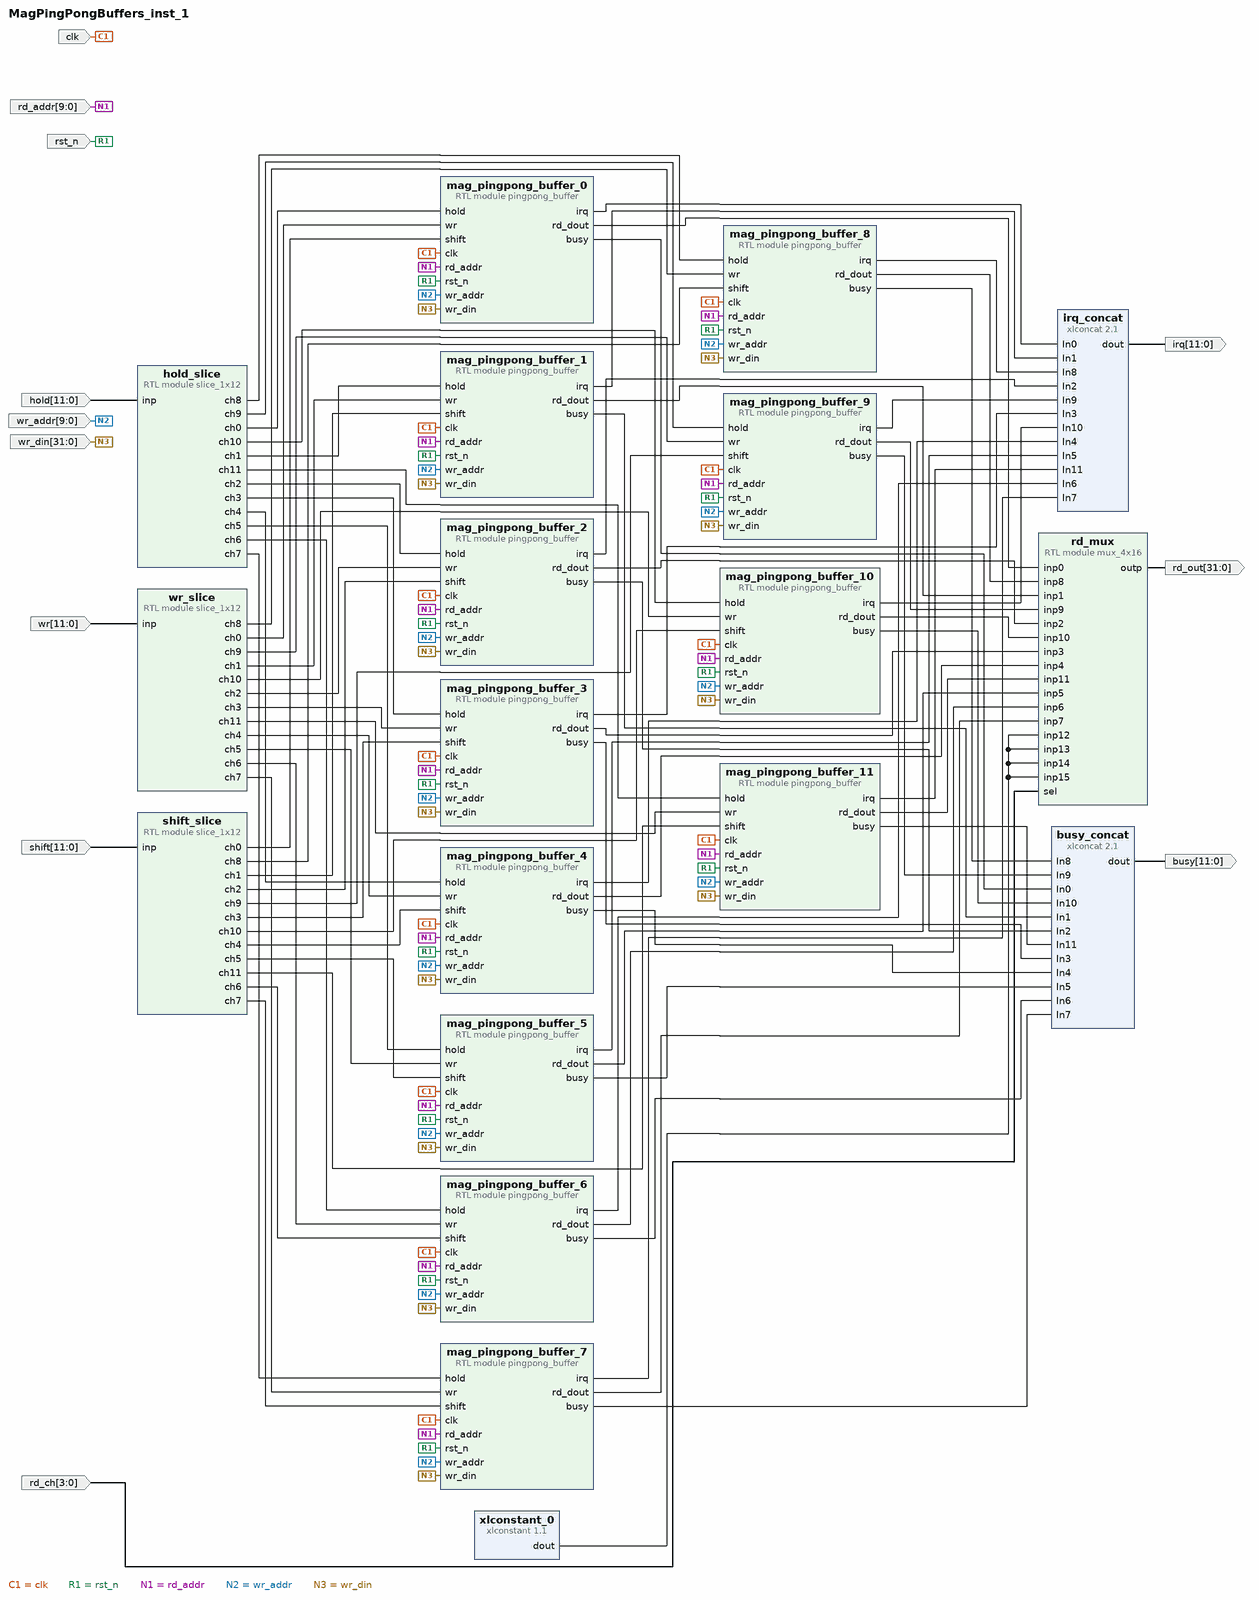
[diagram p0: block diagram of the top level]
# Vivado block design MagPingPongBuffers_inst_1, xczu3eg-sbva484-1-i, Vivado 2020.2
create_bd_design MagPingPongBuffers_inst_1

create_bd_port -dir I -type clk clk
create_bd_port -dir I -type rst rst_n
create_bd_port -dir I -from 9 -to 0 rd_addr
create_bd_port -dir I -from 9 -to 0 wr_addr
create_bd_port -dir I -from 11 -to 0 wr
create_bd_port -dir I -from 11 -to 0 hold
create_bd_port -dir I -from 11 -to 0 shift
create_bd_port -dir I -from 3 -to 0 rd_ch
create_bd_port -dir O -from 11 -to 0 busy
create_bd_port -dir O -from 11 -to 0 irq
create_bd_port -dir I -from 31 -to 0 wr_din
create_bd_port -dir O -from 31 -to 0 rd_out

create_bd_cell -type module -reference slice_1x12 hold_slice
create_bd_cell -type module -reference slice_1x12 shift_slice
create_bd_cell -type ip -vlnv xilinx.com:ip:xlconstant:1.1 xlconstant_0
set_property -dict {CONFIG.CONST_VAL 0 CONFIG.CONST_WIDTH 8} [get_bd_cells xlconstant_0]
create_bd_cell -type ip -vlnv xilinx.com:ip:xlconcat:2.1 busy_concat
set_property -dict {CONFIG.NUM_PORTS 12} [get_bd_cells busy_concat]
create_bd_cell -type ip -vlnv xilinx.com:ip:xlconcat:2.1 irq_concat
set_property -dict {CONFIG.NUM_PORTS 12} [get_bd_cells irq_concat]
create_bd_cell -type module -reference pingpong_buffer mag_pingpong_buffer_0
set_property -dict {CONFIG.addr_width 10 CONFIG.word_width 32} [get_bd_cells mag_pingpong_buffer_0]
create_bd_cell -type module -reference pingpong_buffer mag_pingpong_buffer_10
set_property -dict {CONFIG.addr_width 10 CONFIG.word_width 32} [get_bd_cells mag_pingpong_buffer_10]
create_bd_cell -type module -reference pingpong_buffer mag_pingpong_buffer_11
set_property -dict {CONFIG.addr_width 10 CONFIG.word_width 32} [get_bd_cells mag_pingpong_buffer_11]
create_bd_cell -type module -reference pingpong_buffer mag_pingpong_buffer_1
set_property -dict {CONFIG.addr_width 10 CONFIG.word_width 32} [get_bd_cells mag_pingpong_buffer_1]
create_bd_cell -type module -reference pingpong_buffer mag_pingpong_buffer_2
set_property -dict {CONFIG.addr_width 10 CONFIG.word_width 32} [get_bd_cells mag_pingpong_buffer_2]
create_bd_cell -type module -reference pingpong_buffer mag_pingpong_buffer_3
set_property -dict {CONFIG.addr_width 10 CONFIG.word_width 32} [get_bd_cells mag_pingpong_buffer_3]
create_bd_cell -type module -reference pingpong_buffer mag_pingpong_buffer_4
set_property -dict {CONFIG.addr_width 10 CONFIG.word_width 32} [get_bd_cells mag_pingpong_buffer_4]
create_bd_cell -type module -reference pingpong_buffer mag_pingpong_buffer_5
set_property -dict {CONFIG.addr_width 10 CONFIG.word_width 32} [get_bd_cells mag_pingpong_buffer_5]
create_bd_cell -type module -reference pingpong_buffer mag_pingpong_buffer_6
set_property -dict {CONFIG.addr_width 10 CONFIG.word_width 32} [get_bd_cells mag_pingpong_buffer_6]
create_bd_cell -type module -reference pingpong_buffer mag_pingpong_buffer_7
set_property -dict {CONFIG.addr_width 10 CONFIG.word_width 32} [get_bd_cells mag_pingpong_buffer_7]
create_bd_cell -type module -reference pingpong_buffer mag_pingpong_buffer_8
set_property -dict {CONFIG.addr_width 10 CONFIG.word_width 32} [get_bd_cells mag_pingpong_buffer_8]
create_bd_cell -type module -reference pingpong_buffer mag_pingpong_buffer_9
set_property -dict {CONFIG.addr_width 10 CONFIG.word_width 32} [get_bd_cells mag_pingpong_buffer_9]
create_bd_cell -type module -reference slice_1x12 wr_slice
create_bd_cell -type module -reference mux_4x16 rd_mux
set_property -dict {CONFIG.n_bits 32} [get_bd_cells rd_mux]

# ---- connections ----

connect_bd_net [get_bd_ports clk] \
  [get_bd_pins mag_pingpong_buffer_0/clk] [get_bd_pins mag_pingpong_buffer_10/clk] [get_bd_pins mag_pingpong_buffer_11/clk] \
  [get_bd_pins mag_pingpong_buffer_1/clk] [get_bd_pins mag_pingpong_buffer_2/clk] [get_bd_pins mag_pingpong_buffer_3/clk] \
  [get_bd_pins mag_pingpong_buffer_4/clk] [get_bd_pins mag_pingpong_buffer_5/clk] [get_bd_pins mag_pingpong_buffer_6/clk] \
  [get_bd_pins mag_pingpong_buffer_7/clk] [get_bd_pins mag_pingpong_buffer_8/clk] [get_bd_pins mag_pingpong_buffer_9/clk]
connect_bd_net [get_bd_ports rst_n] \
  [get_bd_pins mag_pingpong_buffer_0/rst_n] [get_bd_pins mag_pingpong_buffer_10/rst_n] \
  [get_bd_pins mag_pingpong_buffer_11/rst_n] [get_bd_pins mag_pingpong_buffer_1/rst_n] \
  [get_bd_pins mag_pingpong_buffer_2/rst_n] [get_bd_pins mag_pingpong_buffer_3/rst_n] \
  [get_bd_pins mag_pingpong_buffer_4/rst_n] [get_bd_pins mag_pingpong_buffer_5/rst_n] \
  [get_bd_pins mag_pingpong_buffer_6/rst_n] [get_bd_pins mag_pingpong_buffer_7/rst_n] \
  [get_bd_pins mag_pingpong_buffer_8/rst_n] [get_bd_pins mag_pingpong_buffer_9/rst_n]
connect_bd_net -net rd_addr_0_1 [get_bd_ports rd_addr] \
  [get_bd_pins mag_pingpong_buffer_0/rd_addr] [get_bd_pins mag_pingpong_buffer_10/rd_addr] \
  [get_bd_pins mag_pingpong_buffer_11/rd_addr] [get_bd_pins mag_pingpong_buffer_1/rd_addr] \
  [get_bd_pins mag_pingpong_buffer_2/rd_addr] [get_bd_pins mag_pingpong_buffer_3/rd_addr] \
  [get_bd_pins mag_pingpong_buffer_4/rd_addr] [get_bd_pins mag_pingpong_buffer_5/rd_addr] \
  [get_bd_pins mag_pingpong_buffer_6/rd_addr] [get_bd_pins mag_pingpong_buffer_7/rd_addr] \
  [get_bd_pins mag_pingpong_buffer_8/rd_addr] [get_bd_pins mag_pingpong_buffer_9/rd_addr]
connect_bd_net -net wr_addr_0_1 [get_bd_ports wr_addr] \
  [get_bd_pins mag_pingpong_buffer_0/wr_addr] [get_bd_pins mag_pingpong_buffer_10/wr_addr] \
  [get_bd_pins mag_pingpong_buffer_11/wr_addr] [get_bd_pins mag_pingpong_buffer_1/wr_addr] \
  [get_bd_pins mag_pingpong_buffer_2/wr_addr] [get_bd_pins mag_pingpong_buffer_3/wr_addr] \
  [get_bd_pins mag_pingpong_buffer_4/wr_addr] [get_bd_pins mag_pingpong_buffer_5/wr_addr] \
  [get_bd_pins mag_pingpong_buffer_6/wr_addr] [get_bd_pins mag_pingpong_buffer_7/wr_addr] \
  [get_bd_pins mag_pingpong_buffer_8/wr_addr] [get_bd_pins mag_pingpong_buffer_9/wr_addr]
connect_bd_net -net wr_din_0_1 [get_bd_ports wr_din] \
  [get_bd_pins mag_pingpong_buffer_0/wr_din] [get_bd_pins mag_pingpong_buffer_10/wr_din] \
  [get_bd_pins mag_pingpong_buffer_11/wr_din] [get_bd_pins mag_pingpong_buffer_1/wr_din] \
  [get_bd_pins mag_pingpong_buffer_2/wr_din] [get_bd_pins mag_pingpong_buffer_3/wr_din] \
  [get_bd_pins mag_pingpong_buffer_4/wr_din] [get_bd_pins mag_pingpong_buffer_5/wr_din] \
  [get_bd_pins mag_pingpong_buffer_6/wr_din] [get_bd_pins mag_pingpong_buffer_7/wr_din] \
  [get_bd_pins mag_pingpong_buffer_8/wr_din] [get_bd_pins mag_pingpong_buffer_9/wr_din]
connect_bd_net -net inp_0_1 [get_bd_ports wr] [get_bd_pins wr_slice/inp]
connect_bd_net [get_bd_pins wr_slice/ch0] [get_bd_pins mag_pingpong_buffer_0/wr]
connect_bd_net [get_bd_pins wr_slice/ch1] [get_bd_pins mag_pingpong_buffer_1/wr]
connect_bd_net [get_bd_pins wr_slice/ch2] [get_bd_pins mag_pingpong_buffer_2/wr]
connect_bd_net [get_bd_pins wr_slice/ch3] [get_bd_pins mag_pingpong_buffer_3/wr]
connect_bd_net [get_bd_pins wr_slice/ch4] [get_bd_pins mag_pingpong_buffer_4/wr]
connect_bd_net [get_bd_pins wr_slice/ch5] [get_bd_pins mag_pingpong_buffer_5/wr]
connect_bd_net [get_bd_pins wr_slice/ch6] [get_bd_pins mag_pingpong_buffer_6/wr]
connect_bd_net [get_bd_pins wr_slice/ch7] [get_bd_pins mag_pingpong_buffer_7/wr]
connect_bd_net [get_bd_pins wr_slice/ch8] [get_bd_pins mag_pingpong_buffer_8/wr]
connect_bd_net [get_bd_pins wr_slice/ch9] [get_bd_pins mag_pingpong_buffer_9/wr]
connect_bd_net [get_bd_pins wr_slice/ch10] [get_bd_pins mag_pingpong_buffer_10/wr]
connect_bd_net [get_bd_pins wr_slice/ch11] [get_bd_pins mag_pingpong_buffer_11/wr]
connect_bd_net -net inp_0_2 [get_bd_ports hold] [get_bd_pins hold_slice/inp]
connect_bd_net [get_bd_pins hold_slice/ch11] [get_bd_pins mag_pingpong_buffer_11/hold]
connect_bd_net [get_bd_pins hold_slice/ch10] [get_bd_pins mag_pingpong_buffer_10/hold]
connect_bd_net [get_bd_pins hold_slice/ch9] [get_bd_pins mag_pingpong_buffer_9/hold]
connect_bd_net [get_bd_pins hold_slice/ch8] [get_bd_pins mag_pingpong_buffer_8/hold]
connect_bd_net [get_bd_pins hold_slice/ch7] [get_bd_pins mag_pingpong_buffer_7/hold]
connect_bd_net [get_bd_pins hold_slice/ch6] [get_bd_pins mag_pingpong_buffer_6/hold]
connect_bd_net [get_bd_pins hold_slice/ch5] [get_bd_pins mag_pingpong_buffer_5/hold]
connect_bd_net [get_bd_pins hold_slice/ch4] [get_bd_pins mag_pingpong_buffer_4/hold]
connect_bd_net [get_bd_pins hold_slice/ch3] [get_bd_pins mag_pingpong_buffer_3/hold]
connect_bd_net [get_bd_pins hold_slice/ch2] [get_bd_pins mag_pingpong_buffer_2/hold]
connect_bd_net [get_bd_pins hold_slice/ch1] [get_bd_pins mag_pingpong_buffer_1/hold]
connect_bd_net [get_bd_pins hold_slice/ch0] [get_bd_pins mag_pingpong_buffer_0/hold]
connect_bd_net [get_bd_pins shift_slice/ch0] [get_bd_pins mag_pingpong_buffer_0/shift]
connect_bd_net [get_bd_pins shift_slice/ch1] [get_bd_pins mag_pingpong_buffer_1/shift]
connect_bd_net [get_bd_pins shift_slice/ch2] [get_bd_pins mag_pingpong_buffer_2/shift]
connect_bd_net [get_bd_pins shift_slice/ch3] [get_bd_pins mag_pingpong_buffer_3/shift]
connect_bd_net [get_bd_pins shift_slice/ch4] [get_bd_pins mag_pingpong_buffer_4/shift]
connect_bd_net [get_bd_pins shift_slice/ch5] [get_bd_pins mag_pingpong_buffer_5/shift]
connect_bd_net [get_bd_pins shift_slice/ch6] [get_bd_pins mag_pingpong_buffer_6/shift]
connect_bd_net [get_bd_pins shift_slice/ch7] [get_bd_pins mag_pingpong_buffer_7/shift]
connect_bd_net [get_bd_pins shift_slice/ch8] [get_bd_pins mag_pingpong_buffer_8/shift]
connect_bd_net [get_bd_pins shift_slice/ch9] [get_bd_pins mag_pingpong_buffer_9/shift]
connect_bd_net [get_bd_pins shift_slice/ch10] [get_bd_pins mag_pingpong_buffer_10/shift]
connect_bd_net [get_bd_pins shift_slice/ch11] [get_bd_pins mag_pingpong_buffer_11/shift]
connect_bd_net -net inp_0_3 [get_bd_ports shift] [get_bd_pins shift_slice/inp]
connect_bd_net -net sel_0_1 [get_bd_ports rd_ch] [get_bd_pins rd_mux/sel]
connect_bd_net [get_bd_pins mag_pingpong_buffer_0/rd_dout] [get_bd_pins rd_mux/inp0]
connect_bd_net [get_bd_pins mag_pingpong_buffer_1/rd_dout] [get_bd_pins rd_mux/inp1]
connect_bd_net [get_bd_pins mag_pingpong_buffer_2/rd_dout] [get_bd_pins rd_mux/inp2]
connect_bd_net [get_bd_pins mag_pingpong_buffer_3/rd_dout] [get_bd_pins rd_mux/inp3]
connect_bd_net [get_bd_pins mag_pingpong_buffer_4/rd_dout] [get_bd_pins rd_mux/inp4]
connect_bd_net [get_bd_pins mag_pingpong_buffer_5/rd_dout] [get_bd_pins rd_mux/inp5]
connect_bd_net [get_bd_pins mag_pingpong_buffer_6/rd_dout] [get_bd_pins rd_mux/inp6]
connect_bd_net [get_bd_pins mag_pingpong_buffer_7/rd_dout] [get_bd_pins rd_mux/inp7]
connect_bd_net [get_bd_pins mag_pingpong_buffer_8/rd_dout] [get_bd_pins rd_mux/inp8]
connect_bd_net [get_bd_pins mag_pingpong_buffer_9/rd_dout] [get_bd_pins rd_mux/inp9]
connect_bd_net [get_bd_pins mag_pingpong_buffer_10/rd_dout] [get_bd_pins rd_mux/inp10]
connect_bd_net [get_bd_pins mag_pingpong_buffer_11/rd_dout] [get_bd_pins rd_mux/inp11]
connect_bd_net [get_bd_pins xlconstant_0/dout] \
  [get_bd_pins rd_mux/inp12] [get_bd_pins rd_mux/inp13] [get_bd_pins rd_mux/inp14] [get_bd_pins rd_mux/inp15]
connect_bd_net [get_bd_pins mag_pingpong_buffer_0/busy] [get_bd_pins busy_concat/In0]
connect_bd_net [get_bd_pins mag_pingpong_buffer_1/busy] [get_bd_pins busy_concat/In1]
connect_bd_net [get_bd_pins mag_pingpong_buffer_2/busy] [get_bd_pins busy_concat/In2]
connect_bd_net [get_bd_pins mag_pingpong_buffer_3/busy] [get_bd_pins busy_concat/In3]
connect_bd_net [get_bd_pins mag_pingpong_buffer_4/busy] [get_bd_pins busy_concat/In4]
connect_bd_net [get_bd_pins mag_pingpong_buffer_5/busy] [get_bd_pins busy_concat/In5]
connect_bd_net [get_bd_pins mag_pingpong_buffer_6/busy] [get_bd_pins busy_concat/In6]
connect_bd_net [get_bd_pins mag_pingpong_buffer_7/busy] [get_bd_pins busy_concat/In7]
connect_bd_net [get_bd_pins mag_pingpong_buffer_8/busy] [get_bd_pins busy_concat/In8]
connect_bd_net [get_bd_pins mag_pingpong_buffer_9/busy] [get_bd_pins busy_concat/In9]
connect_bd_net [get_bd_pins mag_pingpong_buffer_10/busy] [get_bd_pins busy_concat/In10]
connect_bd_net [get_bd_pins mag_pingpong_buffer_11/busy] [get_bd_pins busy_concat/In11]
connect_bd_net [get_bd_pins busy_concat/dout] [get_bd_ports busy]
connect_bd_net [get_bd_pins mag_pingpong_buffer_0/irq] [get_bd_pins irq_concat/In0]
connect_bd_net [get_bd_pins mag_pingpong_buffer_1/irq] [get_bd_pins irq_concat/In1]
connect_bd_net [get_bd_pins mag_pingpong_buffer_2/irq] [get_bd_pins irq_concat/In2]
connect_bd_net [get_bd_pins mag_pingpong_buffer_3/irq] [get_bd_pins irq_concat/In3]
connect_bd_net [get_bd_pins mag_pingpong_buffer_4/irq] [get_bd_pins irq_concat/In4]
connect_bd_net [get_bd_pins mag_pingpong_buffer_5/irq] [get_bd_pins irq_concat/In5]
connect_bd_net [get_bd_pins mag_pingpong_buffer_6/irq] [get_bd_pins irq_concat/In6]
connect_bd_net [get_bd_pins mag_pingpong_buffer_7/irq] [get_bd_pins irq_concat/In7]
connect_bd_net [get_bd_pins mag_pingpong_buffer_8/irq] [get_bd_pins irq_concat/In8]
connect_bd_net [get_bd_pins mag_pingpong_buffer_9/irq] [get_bd_pins irq_concat/In9]
connect_bd_net [get_bd_pins mag_pingpong_buffer_10/irq] [get_bd_pins irq_concat/In10]
connect_bd_net [get_bd_pins mag_pingpong_buffer_11/irq] [get_bd_pins irq_concat/In11]
connect_bd_net [get_bd_pins irq_concat/dout] [get_bd_ports irq]
connect_bd_net [get_bd_pins rd_mux/outp] [get_bd_ports rd_out]

validate_bd_design
save_bd_design
